# EAGLE design PT8211_T3_0.1 (EAGLE 7.4.0)
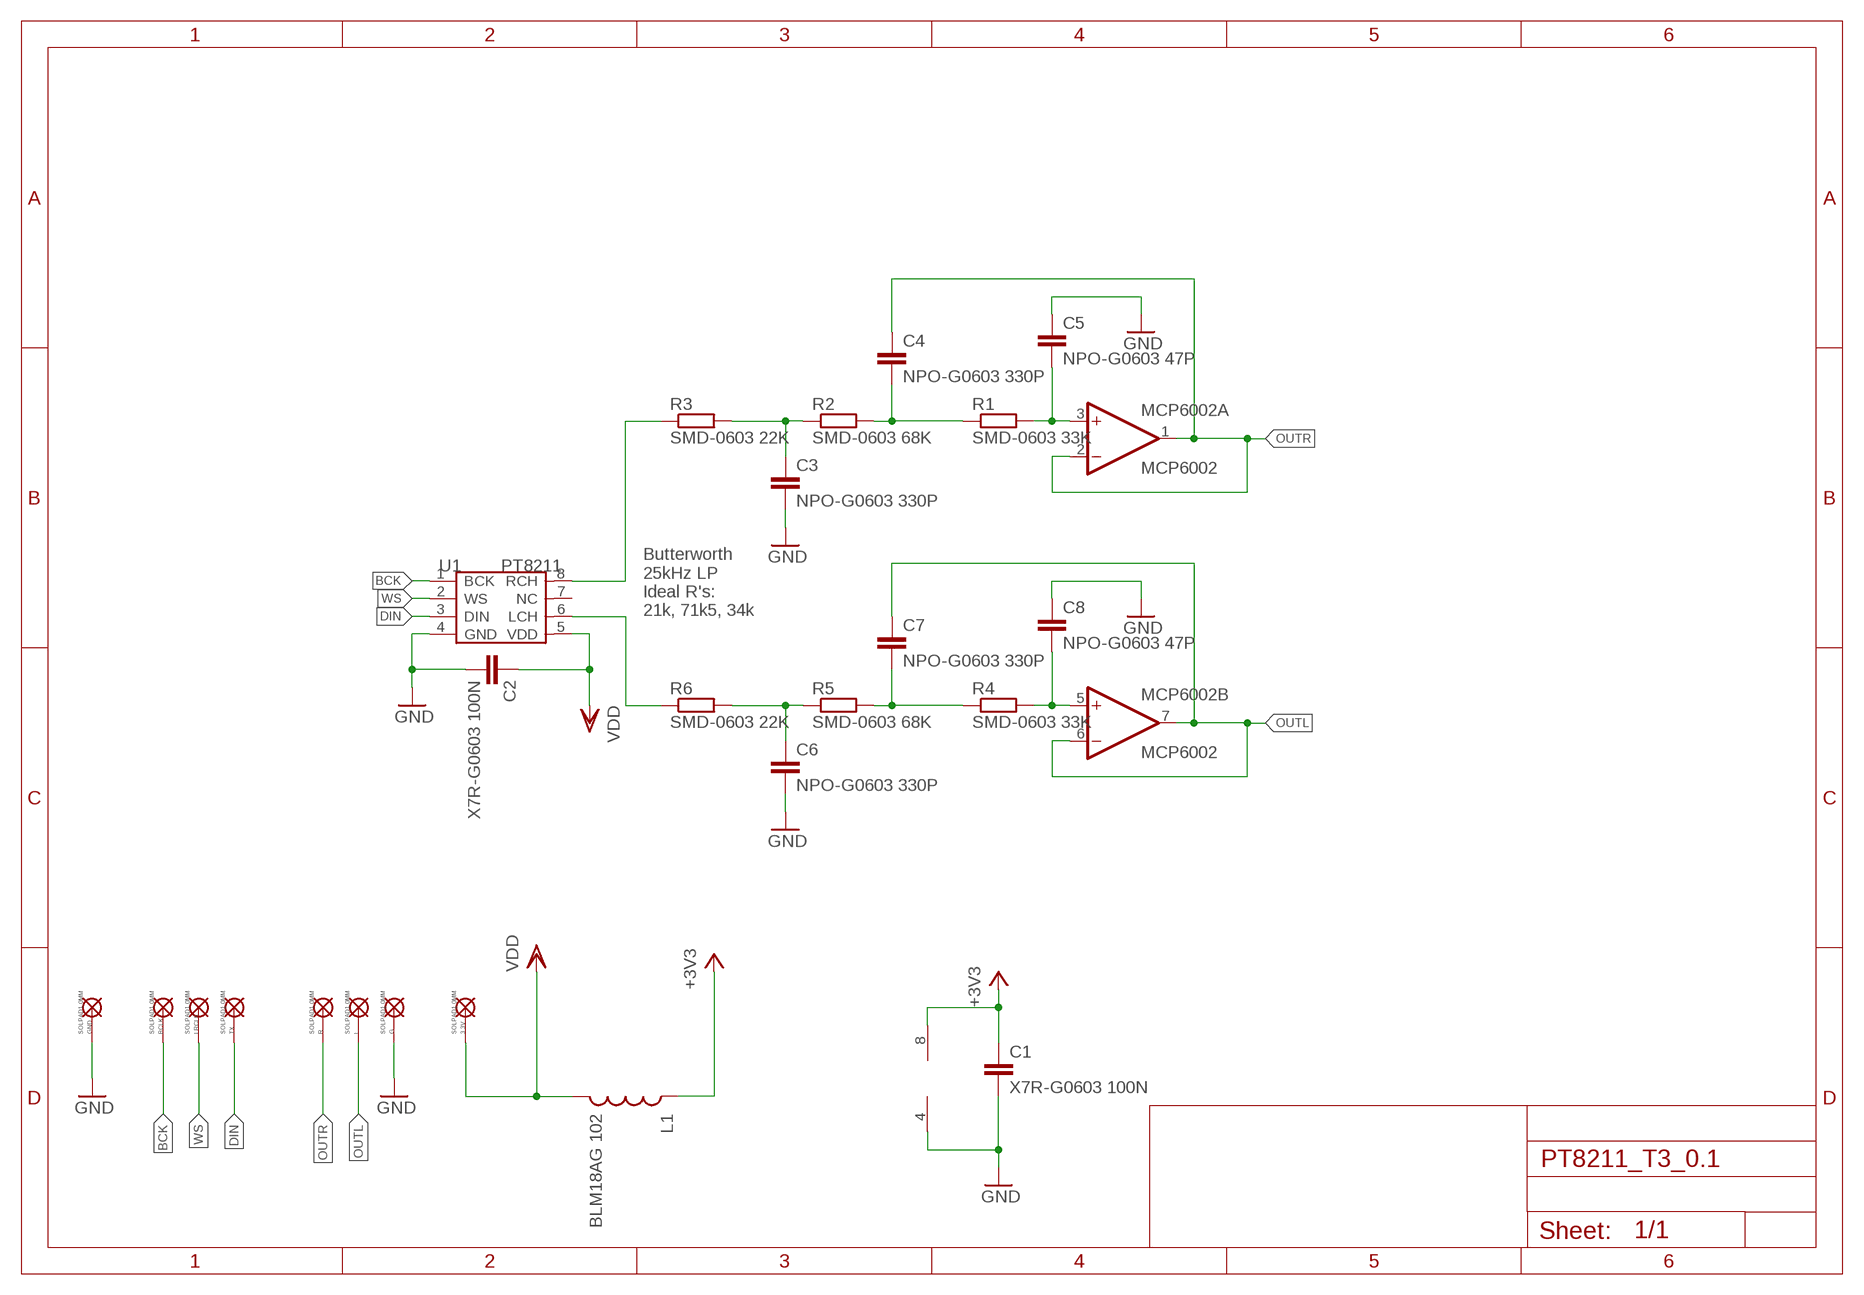
[diagram p0: schematic, sheet 1]

## Parts
3.3V  SOLPAD1,0MM  [SOLPAD1MM]
BCLK  SOLPAD1,0MM  [SOLPAD1MM]
C1  X7R-G0603 100N  C-EUC0603K  [C0603K]
C2  X7R-G0603 100N  C-EUC0603K  [C0603K]
C3  NPO-G0603 330P  C-EUC0603K  [C0603K]
C4  NPO-G0603 330P  C-EUC0603K  [C0603K]
C5  NPO-G0603 47P  C-EUC0603K  [C0603K]
C6  NPO-G0603 330P  C-EUC0603K  [C0603K]
C7  NPO-G0603 330P  C-EUC0603K  [C0603K]
C8  NPO-G0603 47P  C-EUC0603K  [C0603K]
G  SOLPAD1,0MM  [SOLPAD1MM]
GND  SOLPAD1,0MM  [SOLPAD1MM]
L  SOLPAD1,0MM  [SOLPAD1MM]
L1  BLM18AG 102  INDUCTOR0603  [0603]
LRCLK  SOLPAD1,0MM  [SOLPAD1MM]
MCP6002  MCP6002  MCP602SN  [SO08]
R  SOLPAD1,0MM  [SOLPAD1MM]
R1  SMD-0603 33K  R-EU_R0603  [R0603]
R2  SMD-0603 68K  R-EU_R0603  [R0603]
R3  SMD-0603 22K  R-EU_R0603  [R0603]
R4  SMD-0603 33K  R-EU_R0603  [R0603]
R5  SMD-0603 68K  R-EU_R0603  [R0603]
R6  SMD-0603 22K  R-EU_R0603  [R0603]
TX  SOLPAD1,0MM  [SOLPAD1MM]
U1  PT8211  PT8211-SOP8  [SOP8-6.0-4.9X3.9]

## Nets
+3V3: C1.1 L1.1 MCP6002.8(P:V+)
BCK: BCLK.P$1 U1.1(BCK)
DIN: TX.P$1 U1.3(DIN)
GND: C1.2 C2.2 C3.2 C5.1 C6.2 C8.1 G.P$1 GND.P$1 MCP6002.4(P:V-) U1.4(GND)
N$1: C6.1 R5.1 R6.2
N$2: C7.2 R4.1 R5.2
N$3: C8.2 MCP6002.5(B:+IN) R4.2
N$4: C3.1 R2.1 R3.2
N$5: C4.2 R1.1 R2.2
N$6: C5.2 MCP6002.3(A:+IN) R1.2
N$9: R6.1 U1.6(LCH)
N$10: R3.1 U1.8(RCH)
OUTL: C7.1 L.P$1 MCP6002.6(B:-IN) MCP6002.7(B:OUT)
OUTR: C4.1 MCP6002.1(A:OUT) MCP6002.2(A:-IN) R.P$1
VDD: 3.3V.P$1 C2.1 L1.2 U1.5(VDD)
WS: LRCLK.P$1 U1.2(WS)
Unconnected: U1.7(NC)

## Notes on the sheet
- Butterworth
  25kHz LP
  Ideal R's:
  21k, 71k5, 34k

## Library data of the parts
3.3V BCLK G GND L LRCLK R TX = Teensy3_MicroSD:SOLPAD
C1-C8 = rcl:C-EU: CAPACITOR, European symbol
L1 = SparkFun-Passives:INDUCTOR: Inductors Basic Inductor/Choke - 0603 and 1206. Footprints are not proven and vary greatly between part numbers.
MCP6002 = linear:MCP602: Single Op Amp 2.7V to 6.0V Single Supply CMOS Source: http://ww1.microchip.com/downloads/en/DeviceDoc/21314g.pdf
R1-R6 = rcl:R-EU_: RESISTOR, European symbol
U1 = IC:PT8211: 16 Bit Digital to Analog Converter http://www.princeton.com.tw/downloadprocess/downloadfile.asp? mydownload=PT8211.pdf

## Board
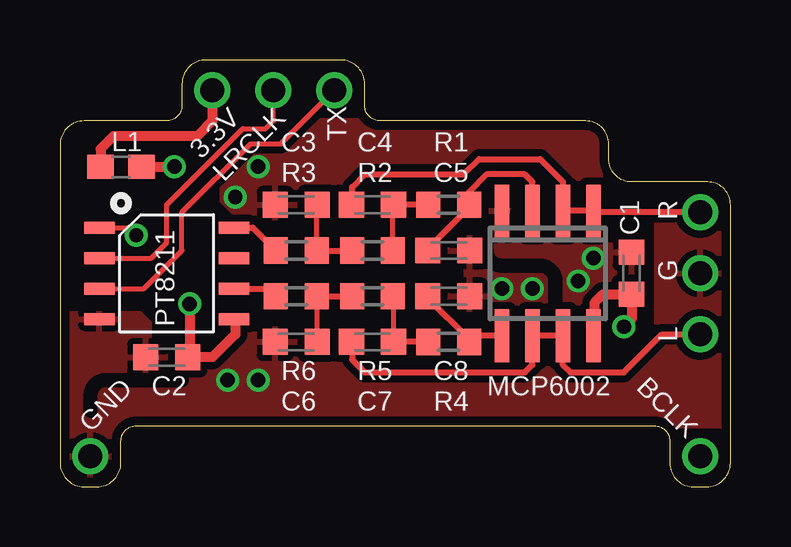
[diagram p1: board, top side]
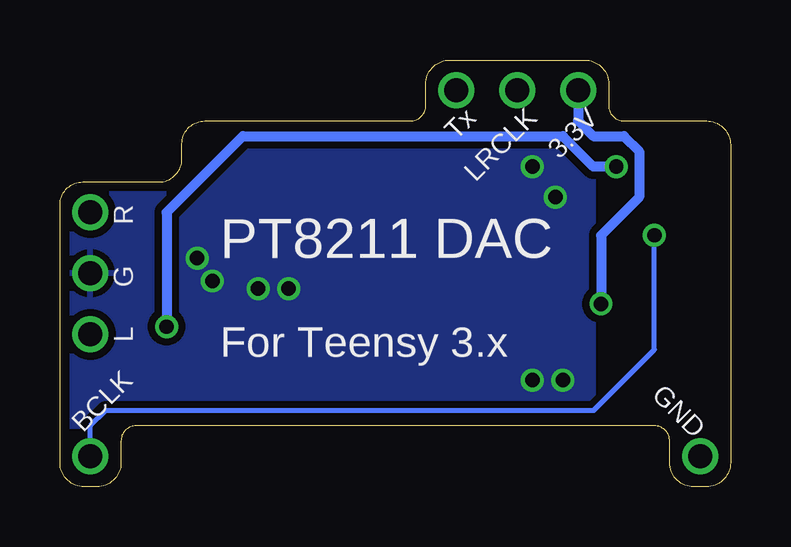
[diagram p2: board, bottom side, seen from below]

Size 27.94 x 17.78 mm. Coordinates in mm from the lower left corner, seen from the top.
Outline: 27.94,1 arc-90 26.94,0 26.4,0 arc-90 25.4,1 25.4,1.91 arc90 24.77,2.54 3.17,2.54 arc90 2.54,1.91 2.54,1 arc-90 1.54,0 1,0 arc-90 0,1 0,14.24 arc-90 1,15.24 4.45,15.24 arc90 5.08,15.88 5.08,16.78 arc-90 6.08,17.78 11.7,17.78 arc-90 12.7,16.78 12.7,15.88 arc90 13.34,15.24 21.91,15.24 arc-90 22.86,14.29 22.86,13.65 arc90 23.81,12.7 26.99,12.7 arc-90 27.94,11.75 27.94,0.95
Copper layers (1*16): Top 0.0356mm / dielectric 1.5011mm / Bottom 0.0356mm
Design rules "oshpark": minimum track width 6mil, minimum drill 13mil, track to track 6mil, track to pad 6mil, pad to pad 6mil, via to via 6mil, smd to smd 6mil, copper to edge 15mil, drill to drill 6mil, minimum pad ring 7mil, minimum via ring 7mil, stop-mask expansion 3mil, vias tented up to drill 0mil, thermal gap 10mil
tRestrict: 22 lines

### Footprints (pad centres in the part's own frame; a part is rotated, then mirrored left to right if it is on the bottom)
SOLPAD1MM = drill 1: P$1 0,0
C0603K = smd 1.05 x 1.08: 1 -0.875,0; 2 0.875,0
0603 = smd 1.1 x 1: 1 -0.85,0; 2 0.85,0
SO08 = smd 0.6 x 2.2: 1 -1.905,-2.6; 2 -0.635,-2.6; 3 0.635,-2.6; 4 1.905,-2.6; 5 1.905,2.6; 6 0.635,2.6; 7 -0.635,2.6; 8 -1.905,2.6
R0603 = smd 1 x 1.1: 1 -0.85,0; 2 0.85,0
SOP8-6.0-4.9X3.9 = smd 0.5 x 1.27: 1 -1.905,-2.8; 2 -0.635,-2.8; 3 0.635,-2.8; 4 1.905,-2.8; 5 1.905,2.8; 6 0.635,2.8; 7 -0.635,2.8; 8 -1.905,2.8

### Placement (x,y rotation side)
3.3V  6.35,16.51 0 top
BCLK  26.67,1.27 0 top
C1  23.81,8.89 90 top
C2  4.45,5.4 180 top
C3  9.84,11.75 180 top
C4  13.02,11.75 0 top
C5  16.19,9.84 180 top
C6  9.84,6.03 180 top
C7  13.02,6.03 0 top
C8  16.19,7.94 180 top
G  26.67,8.89 0 top
GND  1.27,1.27 0 top
L  26.67,6.35 0 top
L1  2.54,13.34 180 top
LRCLK  8.89,16.51 0 top
MCP6002  20.32,8.89 180 top
R  26.67,11.43 0 top
R1  16.19,11.75 0 top
R2  13.02,9.84 0 top
R3  9.84,9.84 0 top
R4  16.19,6.03 0 top
R5  13.02,7.94 0 top
R6  9.84,7.94 0 top
TX  11.43,16.51 0 top
U1  4.45,8.89 270 top

### Tracks (layer width: path | path; a pad name or v marks a point on that pad's centre or on a via)
+3V3  (via drill 0.6)
  Top 0.406: L1.1 v4.76,13.34 | MCP6002.8 22.29,6.35 22.29,7.68 22.62,8.02 C1.1 23.81,6.99 v23.5,6.67
  Bottom 0.406: v23.5,6.67 23.5,11.43 20.32,14.61 6.99,14.61 5.71,13.34 v4.76,13.34
BCK  (via drill 0.6)
  Top 0.203: U1.1 2.86,10.79 v3.17,10.48
  Bottom 0.203: BCLK.P$1 26.67,2.54 26.04,3.17 5.71,3.17 3.17,5.71 v3.17,10.48
DIN
  Top 0.203: U1.3 3.49,8.26 5.08,9.84 5.08,11.43 7.94,14.29 9.21,14.29 TX.P$1
GND  (via drill 0.6)
  other vias: 19.68,8.26 18.41,8.26 8.26,4.45 8.26,13.34 6.99,4.45 22.23,9.53 21.59,8.57 7.3,12.06
  pour Top (isolate 0.305, rank 2): -0.64,15.24 28.57,15.24 28.57,2.54 3.81,2.54 3.81,-0.64 -0.64,-0.64
  pour Bottom (isolate 0.305, rank 2): 5.71,15.24 28.57,15.24 28.57,2.54 5.71,2.54
N$1
  Top 0.203: R6.2 10.69,6.06 C6.1
  Top 0.254: R6.2 R5.1
N$2
  Top 0.203: 13.89,7.91 C7.2
  Top 0.254: R5.2 13.89,7.91 | R4.1 C7.2
N$3
  Top 0.254: C8.2 15.32,7.86 17.04,6.13 R4.2 17.3,6.29 MCP6002.5
N$4
  Top 0.203: R3.2 10.69,11.72 C3.1
  Top 0.254: R3.2 R2.1
N$5
  Top 0.203: R2.2 13.87,11.72 C4.2
  Top 0.254: R1.1 C4.2
N$6
  Top 0.254: MCP6002.3 19.68,12.7 19.37,13.02 17.78,13.02 17.04,12.28 R1.2 17.04,11.64 15.32,9.92 C5.2
N$9
  Top 0.254: U1.6 8.68,8.26 R6.1
N$10
  Top 0.254: U1.8 8.04,10.79 R3.1
OUTL
  Top 0.254: C7.1 12.17,5.29 12.7,4.76 19.37,4.76 19.68,5.08 MCP6002.6 MCP6002.7 20.95,5.08 21.27,4.76 23.5,4.76 25.08,6.35 L.P$1
OUTR
  Top 0.254: C4.1 12.17,12.48 12.7,13.02 16.83,13.02 17.46,13.65 20,13.65 20.95,12.7 MCP6002.2 MCP6002.1 22.29,11.43 R.P$1
VDD  (via drill 0.6)
  Top 0.406: 3.3V.P$1 6.35,15.24 5.71,14.61 2.22,14.61 1.69,14.07 L1.2 | v5.4,7.62 5.4,5.4 | U1.5 7.3,6.93 7.3,6.35 6.35,5.4 5.4,5.4 | 5.4,5.4 C2.1
  Bottom 0.406: 3.3V.P$1 6.35,15.24 5.71,14.61 4.45,14.61 3.81,13.97 3.81,12.06 5.4,10.48 v5.4,7.62
WS
  Top 0.203: U1.2 3.81,9.53 4.45,10.16 4.45,11.75 7.62,14.92 8.57,14.92 8.89,15.24 LRCLK.P$1

### Text on the board
bNames: 3.3V | LRCLK | Tx | R | PT8211 DAC | G | L | For Teensy 3.x | GND | BCLK
Reference: Vin | AGND | 3.3V | 23 LRCLK | 22 TX | 21 | 20 | 19 | 18 | 17 | 16 | 15 | 14 | 13 | A14/DAC | Program | GND | Prog.Btn | 3.3V | VBat | GND | 0 | 1 | 2 | 3 | 4 | 5 | 6 | 7 | 8 | BCLK 9 | 10 | 11 | 12